# EAGLE schematic Yitran_IT900_Hutschiene_1_0 (EAGLE 6.1)
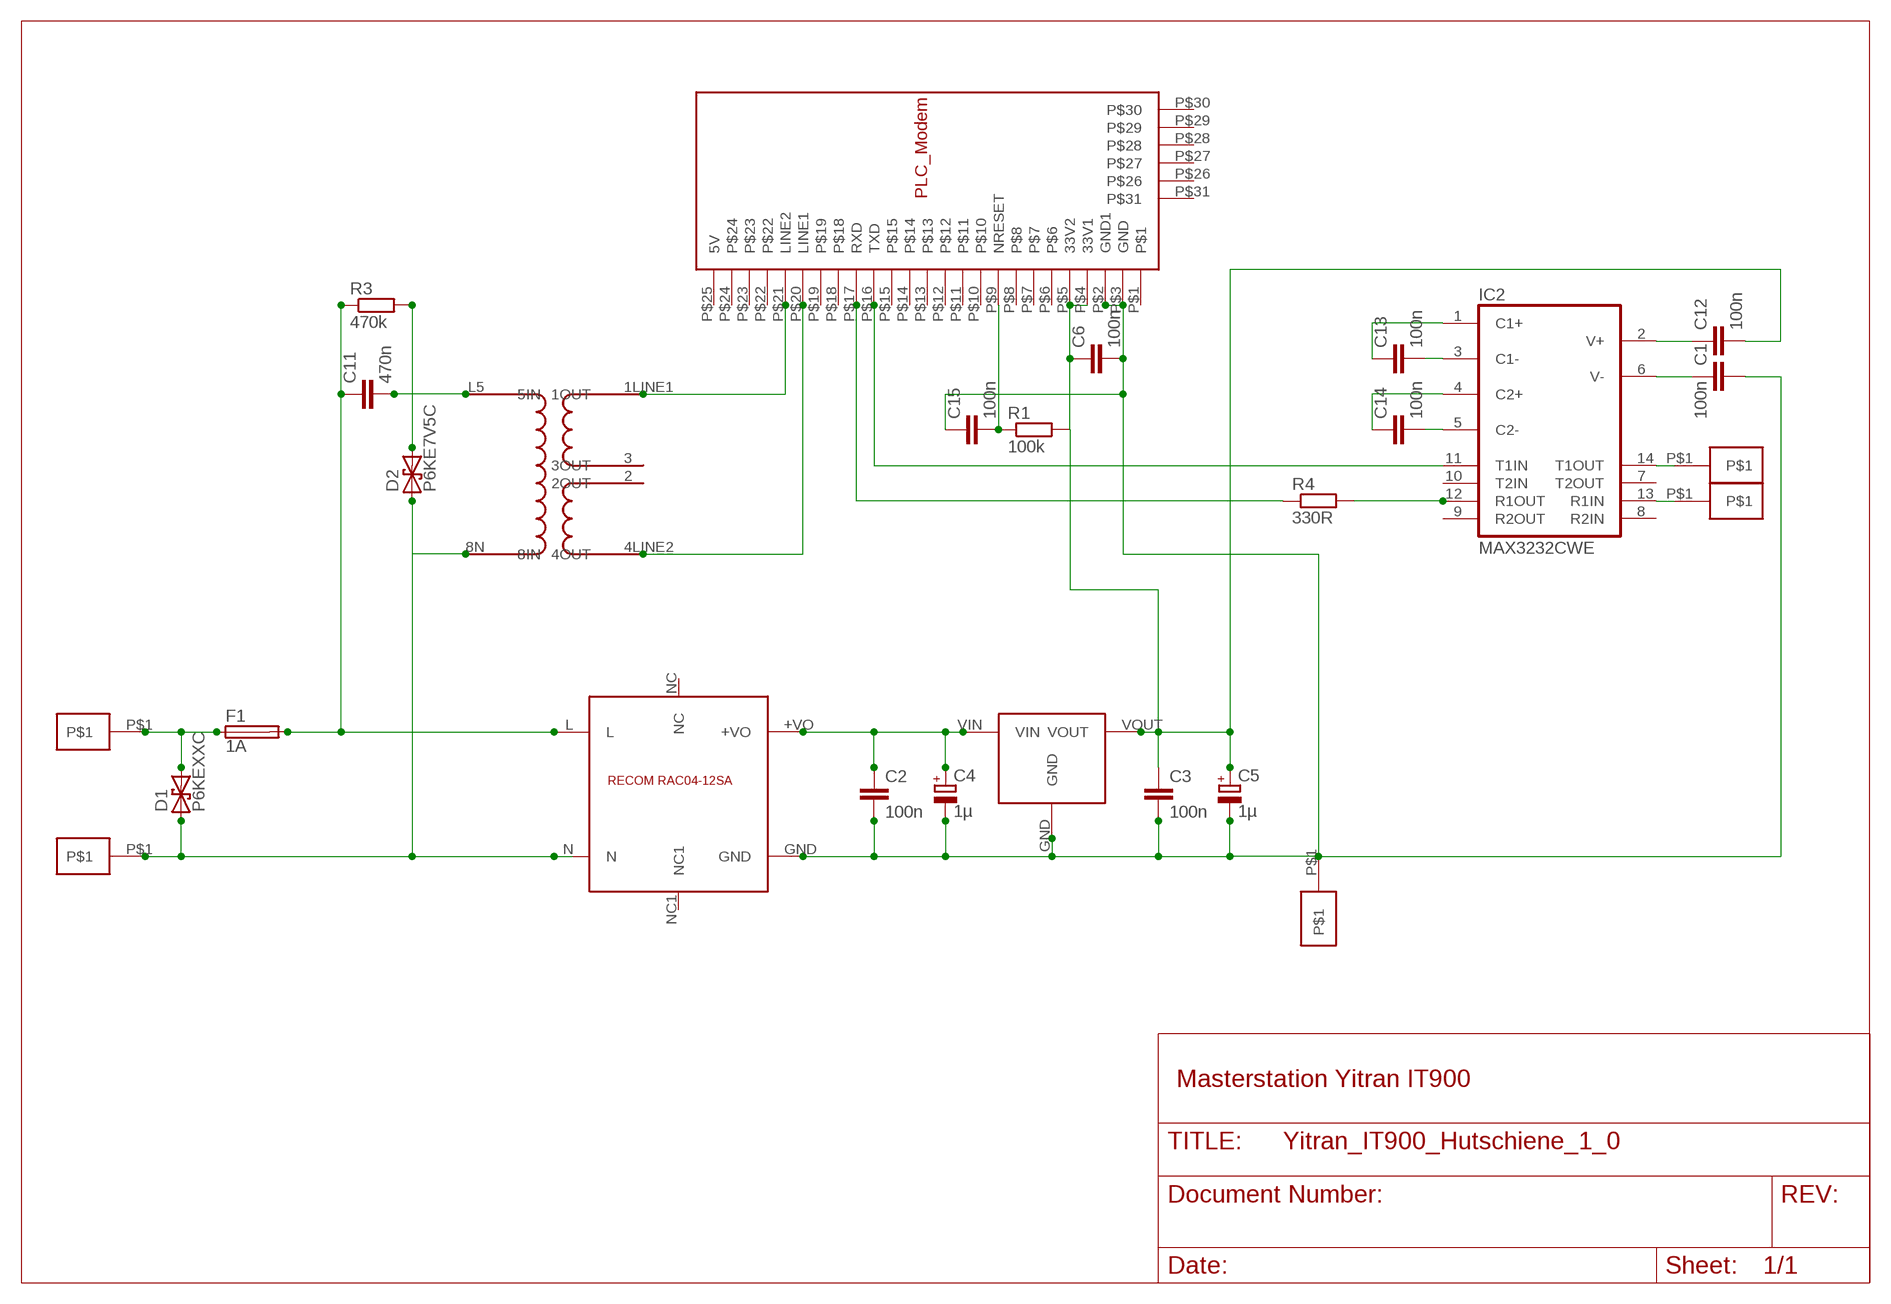
[diagram p0: schematic, sheet 1]

## Parts
C1  100n  C-EUC1206K  [C1206K]
C2  100n  C-EUC1206K  [C1206K]
C3  100n  C-EUC1206K  [C1206K]
C4  1µ  CPOL-EUE2.5-5  [E2,5-5]
C5  1µ  CPOL-EUE2.5-5  [E2,5-5]
C6  100n  C-EUC1206K  [C1206K]
C11  470n  C-EU150-091X182  [C150-091X182]
C12  100n  C-EUC1206K  [C1206K]
C13  100n  C-EUC1206K  [C1206K]
C14  100n  C-EUC1206K  [C1206K]
C15  100n  C-EUC1206K  [C1206K]
D1  P6KEXXC  [CB417-15]
D2  P6KE7V5C  P6KEXXC  [CB417-15]
F1  1A  TR5  [TR5]
GND  PN4  [PIN2]
IC2  MAX3232CWE  [SO16L]
PL1  PN4  [PIN2]
PL2  PN4  [PIN2]
R1  100k  R-EU_M1406  [M1406]
R3  470k  R-EU_0309/10  [0309/10]
R4  330R  R-EU_R1206  [R1206]
RXD  PN4  [PIN2]
TXD  PN4  [PIN2]
U$1  RECOM_783_3  RECOM_785_05  [RECOM785X]
U$3  MODEMSTECKER  [MODEM_FUSS]
U$9  RECOM_RAC04_12SA  [RAC04_12SA]
U$10  PLC_UEBERTRAGER_V2  [PLC-UEBERTRAGER_V2]

## Nets
33V: C3.1 C5.+ C6.1 C12.2 R1.2 U$1.VOUT U$3.P$4(33V1) U$3.P$5(33V2)
GND: C1.2 C2.2 C3.2 C4.- C5.- C6.2 C15.1 GND.P$1 U$1.GND U$3.P$2(GND1) U$3.P$3(GND) U$9.GND
L: C11.1 F1.2 R3.1 U$9.L
N: D1.A D2.A PL2.P$1 U$9.N U$10.8N(8IN)
N$1: D1.C F1.1 PL1.P$1
N$2: C11.2 D2.C R3.2 U$10.L5(5IN)
N$3: C2.1 C4.+ U$1.VIN U$9.+VO
N$5: U$3.P$21(LINE2) U$10.1LINE1(1OUT)
N$6: U$3.P$20(LINE1) U$10.4LINE2(4OUT)
N$7: C13.1 IC2.1(C1+)
N$8: C13.2 IC2.3(C1-)
N$9: C14.1 IC2.4(C2+)
N$10: C14.2 IC2.5(C2-)
N$11: C12.1 IC2.2(V+)
N$12: C1.1 IC2.6(V-)
N$16: IC2.11(T1IN) U$3.P$16(TXD)
N$17: IC2.12(R1OUT) R4.2
N$18: R4.1 U$3.P$17(RXD)
N$19: C15.2 R1.1 U$3.P$9(NRESET)
RXD: IC2.13(R1IN) RXD.P$1
TXD: IC2.14(T1OUT) TXD.P$1
Unconnected: IC2.7(T2OUT) IC2.8(R2IN) IC2.9(R2OUT) IC2.10(T2IN) U$3.P$1 U$3.P$6 U$3.P$7 U$3.P$8 U$3.P$10 U$3.P$11 U$3.P$12 U$3.P$13 U$3.P$14 U$3.P$15 U$3.P$18 U$3.P$19 U$3.P$22 U$3.P$23 U$3.P$24 U$3.P$25(5V) U$3.P$26 U$3.P$27 U$3.P$28 U$3.P$29 U$3.P$30 U$3.P$31 U$9.NC U$9.NC1 U$10.2(2OUT) U$10.3(3OUT)

## Notes on the sheet
- Masterstation Yitran IT900

## Power pins joined to a net without a drawn wire
GND: IC2.15(GND)
VCC: IC2.16(VCC)

## Library data of the parts
C1-C3 C6 C11-C15 = resistor:C-EU: CAPACITOR, European symbol
C4 C5 = resistor:CPOL-EU: POLARIZED CAPACITOR, European symbol
D1 D2 = diode:P6KEXXC: DIODE transient-voltage suppressor
F1 = fuse:TR5: FUSE Wickmann; OC_FARNELL: unknown; OC_NEWARK: unknown
GND PL1 PL2 RXD TXD = Strommessung:PN4
IC2 = maxim:MAX3232*: True RS-232 Transceivers 3.0V to 5.5V, Low-Power up to 1Mbps, Using Four 0.1µF External Capacitors Source: http://pdfserv.maxim-ic.com/en/ds/MAX3222-MAX3241.pdf; MF: MAXIM; MPN: MAX3232CWE+; OC_FARNELL: 9725504; OC_NEWARK: 68K4630
R1 R3 R4 = resistor:R-EU_: RESISTOR, European symbol
U$1 = ADS:RECOM_785_05
U$3 = ADS:MODEMSTECKER
U$9 = ADS:RECOM_RAC04_12SA
U$10 = ADS:PLC_UEBERTRAGER_V2